# EAGLE design room_sensor_esp32_old (EAGLE 9.6.2)
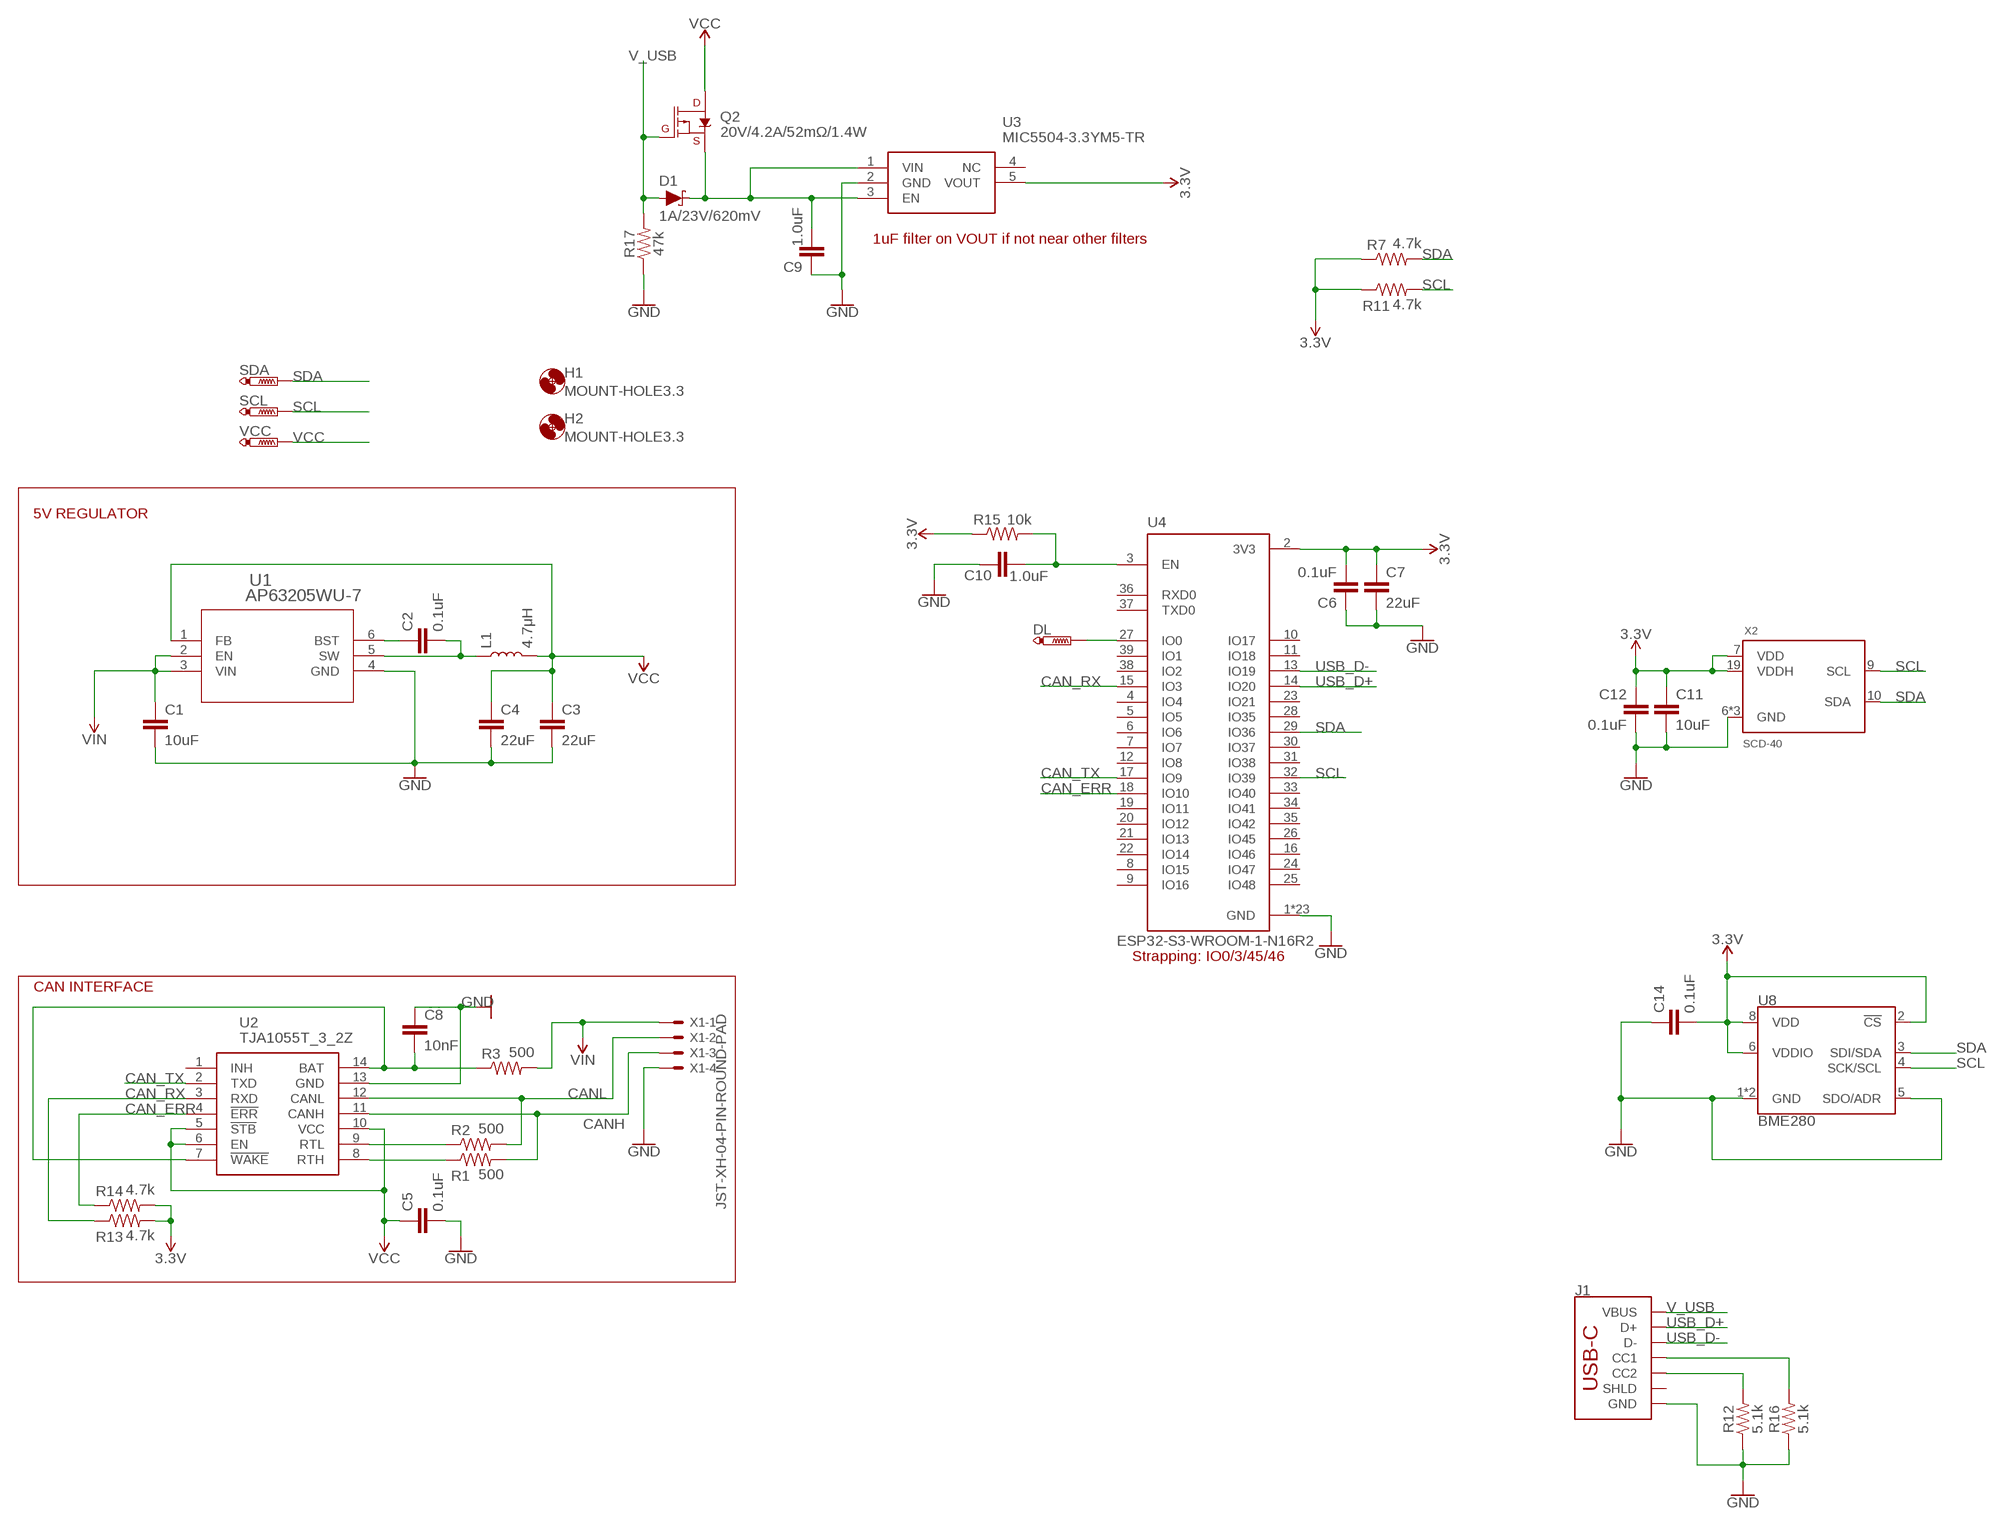
[diagram p0: schematic, sheet 1]

## Parts
C1  10uF  10UF-1210-50V-20%  [1210]
C2  0.1uF  0.1UF-0603-25V-5%  [0603]
C3  22uF  22UF-0805-6.3V-20%  [0805]
C4  22uF  22UF-0805-6.3V-20%  [0805]
C5  0.1uF  0.1UF-0603-25V-5%  [0603]
C6  0.1uF  0.1UF-0603-25V-5%  [0603]
C7  22uF  22UF-0805-6.3V-20%  [0805]
C8  10nF  10NF-0603-50V-10%  [0603]
C9  1.0uF  1.0UF-0603-16V-10%  [0603]
C10  1.0uF  1.0UF-0603-16V-10%  [0603]
C11  10uF  10UF-1210-50V-20%  [1210]
C12  0.1uF  0.1UF-0603-25V-5%  [0603]
C14  0.1uF  0.1UF-0603-25V-5%  [0603]
D1  1A/23V/620mV  DIODE-SCHOTTKY-BAT20J  [SOD-323]
DL  PTR1B1,27  [B1,27]
H1  MOUNT-HOLE3.3  [3,3]
H2  MOUNT-HOLE3.3  [3,3]
J1  USB_C_2-LAYER_PADS  [USB-C-16P-2LAYER-PADS]
L1  4.7μH  4.7μH_SHIELDED_INDUCTORNPIS_LS  [INDUCTOR_4X4MM]
Q2  20V/4.2A/52mΩ/1.4W  MOSFET_PCH-DMG2305UX-7  [SOT23-3]
R1  500  RESISTOR0603  [0603]
R2  500  RESISTOR0603  [0603]
R3  500  RESISTOR0603  [0603]
R7  4.7k  4.7KOHM-0603-1/10W-1%  [0603]
R11  4.7k  4.7KOHM-0603-1/10W-1%  [0603]
R12  5.1k  5.1KOHM5.1KOHM-0603-1/10W-1%  [0603]
R13  4.7k  4.7KOHM-0603-1/10W-1%  [0603]
R14  4.7k  4.7KOHM-0603-1/10W-1%  [0603]
R15  10k  10KOHM-0603-1/10W-1%  [0603]
R16  5.1k  5.1KOHM5.1KOHM-0603-1/10W-1%  [0603]
R17  47k  47KOHM-0603-1/10W-1%  [0603]
SCL  PTR1B1,27  [B1,27]
SDA  PTR1B1,27  [B1,27]
U1  AP63205WU-7  [SOIC_05WU-7_DIO]
U2  TJA1055T_3_2Z  [SOIC127P600X175-14N]
U3  MIC5504-3.3YM5-TR  [SOT95P280X145-5N]
U4  ESP32-S3-WROOM-1-N16R2  [XCVR_ESP32-S3-WROOM-1-N16R2]
U8  BME280  [LGA-8-2.5X2.5]
VCC  PTR1B1,27  [B1,27]
X1  JST-XH-04-PIN-ROUND-PAD  [JST-XH-04-PACKAGE-ROUND-PAD]
X2  SCD-40  [SCD40]

## Nets
3.3V: C6.2 C7.1 C11.1 C12.2 C14.2 R7.1 R11.1 R13.2 R14.2 R15.1 U3.5(VOUT) U4.2(3V3) U8.2(!CS) U8.6(VDDIO) U8.8(VDD) X2.7(VDD) X2.19(VDDH)
CAN_ERR: R14.1 U2.4(!ERR) U4.18(IO10)
CAN_RX: R13.1 U2.3(RXD) U4.15(IO3)
CAN_TX: U2.2(TXD) U4.17(IO9)
CANH: R1.2 U2.11(CANH) X1.3
CANL: R2.2 U2.12(CANL) X1.2
GND: C1.2 C3.2 C4.2 C5.2 C6.1 C7.2 C8.1 C9.1 C10.1 C11.2 C12.1 C14.1 J1.GND J1.GND2(GND) R12.1 R16.1 R17.1 U1.4(GND) U2.13(GND) U3.2(GND) U4.1(GND) U4.40(GND) U4.41_1(GND) U4.41_2(GND) U4.41_3(GND) U4.41_4(GND) U4.41_5(GND) U4.41_6(GND) U4.41_7(GND) U4.41_8(GND) U4.41_9(GND) U4.41_10(GND) U4.41_11(GND) U4.41_12(GND) U4.41_13(GND) U4.41_14(GND) U4.41_15(GND) U4.41_16(GND) U4.41_17(GND) U4.41_18(GND) U4.41_19(GND) U4.41_20(GND) U4.41_21(GND) U8.1(GND) U8.5(SDO/ADR) U8.7(GND) X1.4 X2.6(GND) X2.20(GND) X2.P$1(GND)
N$1: C2.2 L1.P$1 U1.5(SW)
N$2: C2.1 U1.6(BST)
N$3: DL.TP U4.27(IO0)
N$5: R2.1 U2.9(RTL)
N$6: R1.1 U2.8(RTH)
N$7: J1.A5(CC1) R16.2
N$8: C8.2 R3.1 U2.7(!WAKE) U2.14(BAT)
N$9: C10.2 R15.2 U4.3(EN)
N$14: J1.B5(CC2) R12.2
REG_IN: C9.2 D1.C Q2.2(S) U3.1(VIN) U3.3(EN)
SCL: R11.2 SCL.TP U4.32(IO39) U8.4(SCK/SCL) X2.9(SCL)
SDA: R7.2 SDA.TP U4.29(IO36) U8.3(SDI/SDA) X2.10(SDA)
USB_D+: J1.A6(D+) J1.B6(D+) U4.14(IO20)
USB_D-: J1.A7(D-) J1.B7(D-) U4.13(IO19)
V_USB: D1.A J1.VBUS1(VBUS) J1.VBUS2(VBUS) Q2.1(G) R17.2
VCC: C3.1 C4.1 C5.1 L1.P$2 Q2.3(D) U1.1(FB) U2.5(!STB) U2.6(EN) U2.10(VCC) VCC.TP
VIN: C1.1 R3.2 U1.2(EN) U1.3(VIN) X1.1
Unconnected: J1.SHLD1(SHLD) J1.SHLD2(SHLD) J1.SHLD3(SHLD) J1.SHLD4(SHLD) U2.1(INH) U3.4(NC) U4.4(IO4) U4.5(IO5) U4.6(IO6) U4.7(IO7) U4.8(IO15) U4.9(IO16) U4.10(IO17) U4.11(IO18) U4.12(IO8) U4.16(IO46) U4.19(IO11) U4.20(IO12) U4.21(IO13) U4.22(IO14) U4.23(IO21) U4.24(IO47) U4.25(IO48) U4.26(IO45) U4.28(IO35) U4.30(IO37) U4.31(IO38) U4.33(IO40) U4.34(IO41) U4.35(IO42) U4.36(RXD0) U4.37(TXD0) U4.38(IO2) U4.39(IO1)

## Notes on the sheet
- 1uF filter on VOUT if not near other filters
- 5V REGULATOR
- Strapping: IO0/3/45/46
- CAN INTERFACE

## Library data of the parts
C1 C11 = SparkFun-Capacitors:10UF: 10.0µF ceramic capacitors A capacitor is a passive two-terminal electrical component used to store electrical energy temporarily in an electric field.; PROD_ID: CAP-09824
C2 C5 C6 C12 C14 = SparkFun-Capacitors:0.1UF: 0.1µF ceramic capacitors A capacitor is a passive two-terminal electrical component used to store electrical energy temporarily in an electric field.; PROD_ID: CAP-08604
C3 C4 C7 = SparkFun-Capacitors:22UF: 22µF ceramic capacitors A capacitor is a passive two-terminal electrical component used to store electrical energy temporarily in an electric field.; PROD_ID: CAP-08402
C8 = SparkFun-Capacitors:10NF: 0.01uF/10nF/10,000pF ceramic capacitors A capacitor is a passive two-terminal electrical component used to store electrical energy temporarily in an electric field. CAP-09321; PROD_ID: CAP-00867
C9 C10 = SparkFun-Capacitors:1.0UF: 1µF ceramic capacitors A capacitor is a passive two-terminal electrical component used to store electrical energy temporarily in an electric field.; PROD_ID: CAP-00868
D1 = SparkFun-DiscreteSemi:DIODE-SCHOTTKY: Schottky diode A Schottky diode is a semiconductor diode which has a low forward voltage drop and a very fast switching action.; PROD_ID: DIO-11623
DL SCL SDA VCC = testpad:PTR1: TEST PIN
H1 H2 = holes:MOUNT-HOLE: MOUNTING HOLE with drill center marker
J1 = SparkFun-Connectors:USB_C: USB Type C 16Pin Connector Super Speed pins not available on the 16-pin purely SMD connector so this part is best for USB 2.0 implementations. D1 and D2 are tied together enabling D+/- no matter which way the cable is plugged into the connector. The two channel configuration pins (CC1/2) are exposed. These are normally connected to ground via 5.1k resistors but can be reconfigured for high current/high power applications. **4-LAYER BOARD WARNING!!** If designing 4-layer board, make sure to select the variant _4-LAYER-ISOLATED. The linked footprint (USB-C-16-4LAYER-ISOLATED) includes some very necessary cutout polygons in the inner layers (2 and 15). This prevents the PTH mounting shield legs on the USB connector from electrically connecting any other polygons on the inner layers (usually VCC and GND).; PROD_ID: CONN-14122
L1 = SparkFun-Coils:4.7μH_SHIELDED_INDUCTOR: 4.7uH Inductor 4.7uH 1.4A 50mOhm 1008(2520) Package Shielded; PROD_ID: NDUC-15245
Q2 = SparkFun-DiscreteSemi:MOSFET_PCH: P-channel MOSFETs Voltage controlled devices that allow control of high current outputs. SparkFun Products: SparkFun ESP32 Thing <https://www.sparkfun.com/products/13907> SparkFun ESP8266 Thing <https://www.sparkfun.com/products/13231> SparkFun Pi Servo HAT V2 <https://www.sparkfun.com/products/15316> DMG2305UX-7 (20V/4.2A/SOT23-3); PROD_ID: TRANS-14388
R1-R3 = SparkFun-Resistors:RESISTOR: Generic Resistor Package
R7 R11 R13 R14 = SparkFun-Resistors:4.7KOHM: 4.7kΩ resistor A resistor is a passive two-terminal electrical component that implements electrical resistance as a circuit element. Resistors act to reduce current flow, and, at the same time, act to lower voltage levels within circuits. - Wikipedia; PROD_ID: RES-07857
R12 R16 = SparkFun-Resistors:5.1KOHM; PROD_ID: RES-12083
R15 = SparkFun-Resistors:10KOHM: 10kΩ resistor A resistor is a passive two-terminal electrical component that implements electrical resistance as a circuit element. Resistors act to reduce current flow, and, at the same time, act to lower voltage levels within circuits. - Wikipedia; PROD_ID: RES-00824
R17 = SparkFun-Resistors:47KOHM: 47kΩ resistor A resistor is a passive two-terminal electrical component that implements electrical resistance as a circuit element. Resistors act to reduce current flow, and, at the same time, act to lower voltage levels within circuits. - Wikipedia; PROD_ID: RES-07871
U1 = Diodes buck converter:AP63205WU-7; COPYRIGHT: Copyright (C) 2023 Ultra Librarian. All rights reserved.; MANUFACTURER_PART_NUMBER: AP63205WU-7; MFR_NAME: Diodes Inc
U2 = TJA1055T_3_2Z:TJA1055T_3_2Z: CAN Interface IC Enhanced fault-tolerant CAN transceiver Source: Datasheet <http://www.nxp.com/docs/en/data-sheet/TJA1055.pdf>; DESCRIPTION: CAN Interface IC Enhanced fault-tolerant CAN transceiver; HEIGHT: 1.75mm; MANUFACTURER_NAME: NXP; MANUFACTURER_PART_NUMBER: TJA1055T/3/2Z; MOUSER_PART_NUMBER: 771-TJA1055T/3/2Z; MOUSER_PRICE-STOCK: https://www.mouser.co.uk/ProductDetail/NXP-Semiconductors/TJA1055T-3-2Z?qs=qSfuJ%252Bfl%2Fd73Y%2FIsMw3Ayg%3D%3D
U3 = MIC5504-3.3YM5-TR:MIC5504-3.3YM5-TR: MICROCHIP - MIC5504-3.3YM5-TR - LDO VOLT REG, 0.3A, 3.3V, SOT-23-5 Source: Datasheet <https://componentsearchengine.com/Datasheets/2/MIC5504-3.3YM5-TR.pdf>; DESCRIPTION: MICROCHIP - MIC5504-3.3YM5-TR - LDO VOLT REG, 0.3A, 3.3V, SOT-23-5; HEIGHT: 1.45mm; MANUFACTURER_NAME: Microchip; MANUFACTURER_PART_NUMBER: MIC5504-3.3YM5-TR; MOUSER_PART_NUMBER: 998-MIC5504-3.3YM5TR; MOUSER_PRICE-STOCK: https://www.mouser.co.uk/ProductDetail/Microchip-Technology/MIC5504-3.3YM5-TR?qs=U6T8BxXiZAUmVQ5Zs217qQ%3D%3D
U4 = ESP32-S3-WROOM-1-N16R2:ESP32-S3-WROOM-1-N16R2: Check availability <https://pricing.snapeda.com/parts/ESP32S3WROOM1N16R2/Espressif%20Systems/view-part?ref=eda>; AVAILABILITY: In Stock; CHECK_PRICES: https://www.snapeda.com/parts/ESP32S3WROOM1N16R2/Espressif+Systems/view-part/?ref=eda; DESCRIPTION: Bluetooth, WiFi 802.11b/g/n, Bluetooth v5.0 Transceiver Module 2.4GHz PCB Trace Surface Mount; MF: Espressif Systems; MP: ESP32S3WROOM1N16R2; PACKAGE: NON STANDARD Espressif Systems; PRICE: None; PURCHASE-URL: https://www.snapeda.com/api/url_track_click_mouser/?unipart_id=10874217&manufacturer=Espressif Systems&part_name=ESP32S3WROOM1N16R2&search_term=None; SNAPEDA_LINK: https://www.snapeda.com/parts/ESP32S3WROOM1N16R2/Espressif+Systems/view-part/?ref=snap
U8 = SparkFun-Sensors:BME280: Bosch BME280 – Combined Humidity and Pressure Sensor The BME280 is as combined digital humidity, pressure and temperature sensor based on proven sensing principles. The sensor module is housed in an extremely compact metal-lid LGA package with a footprint of only 2.5×2.5mm² with a height of 0.93mm. Its small dimensions and its low power consumption allow the implementation in battery driven devices such as handsets, GPS modules or watches. Datasheet <https://cdn.sparkfun.com/assets/learn_tutorials/4/1/9/BST-BME280_DS001-10.pdf> SparkFun Products SparkFun Atmospheric Sensor Breakout - BME280 <https://www.sparkfun.com/products/13676> (SEN-13676); PROD_ID: IC-13090
X1 = Rembrandt Electronics - JST XH Connectors v1-0:JST-XH-04-PIN: JST XH Connector 2 Pin Wire to board connector. Pitch: 2,54 mm, (0.100") Number of pins: 4 Created by Rembrandt Electronics www.rembrandtelectronics.com
X2 = Adafruit SCD-41:SCD-40

## Board
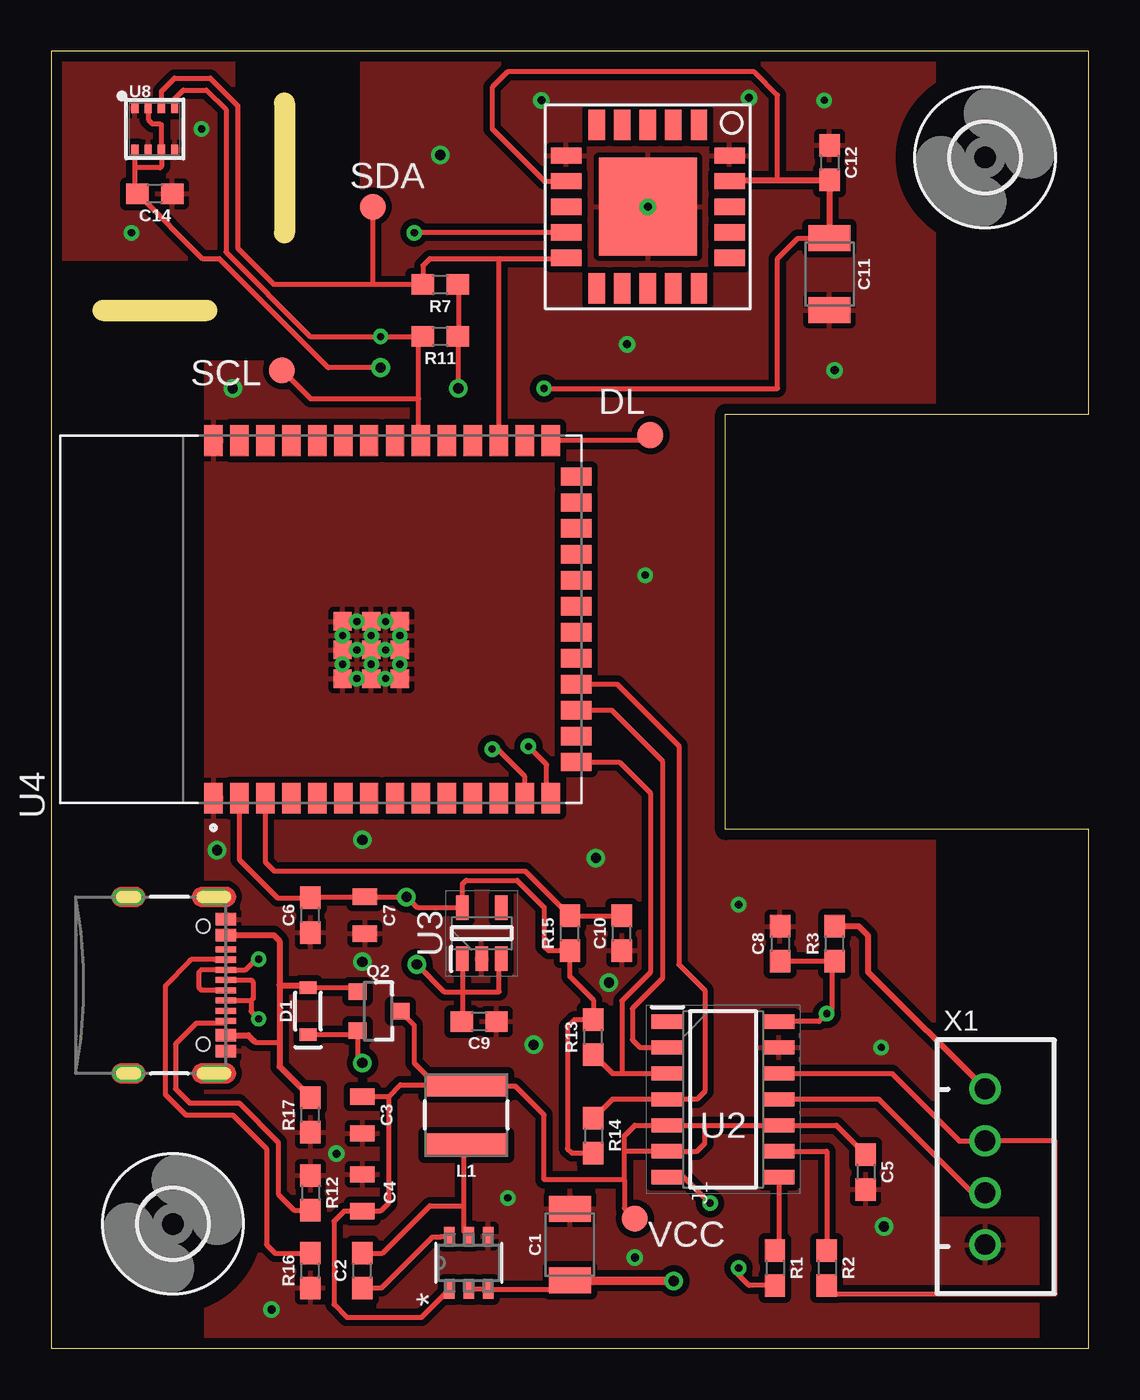
[diagram p1: board, top side]
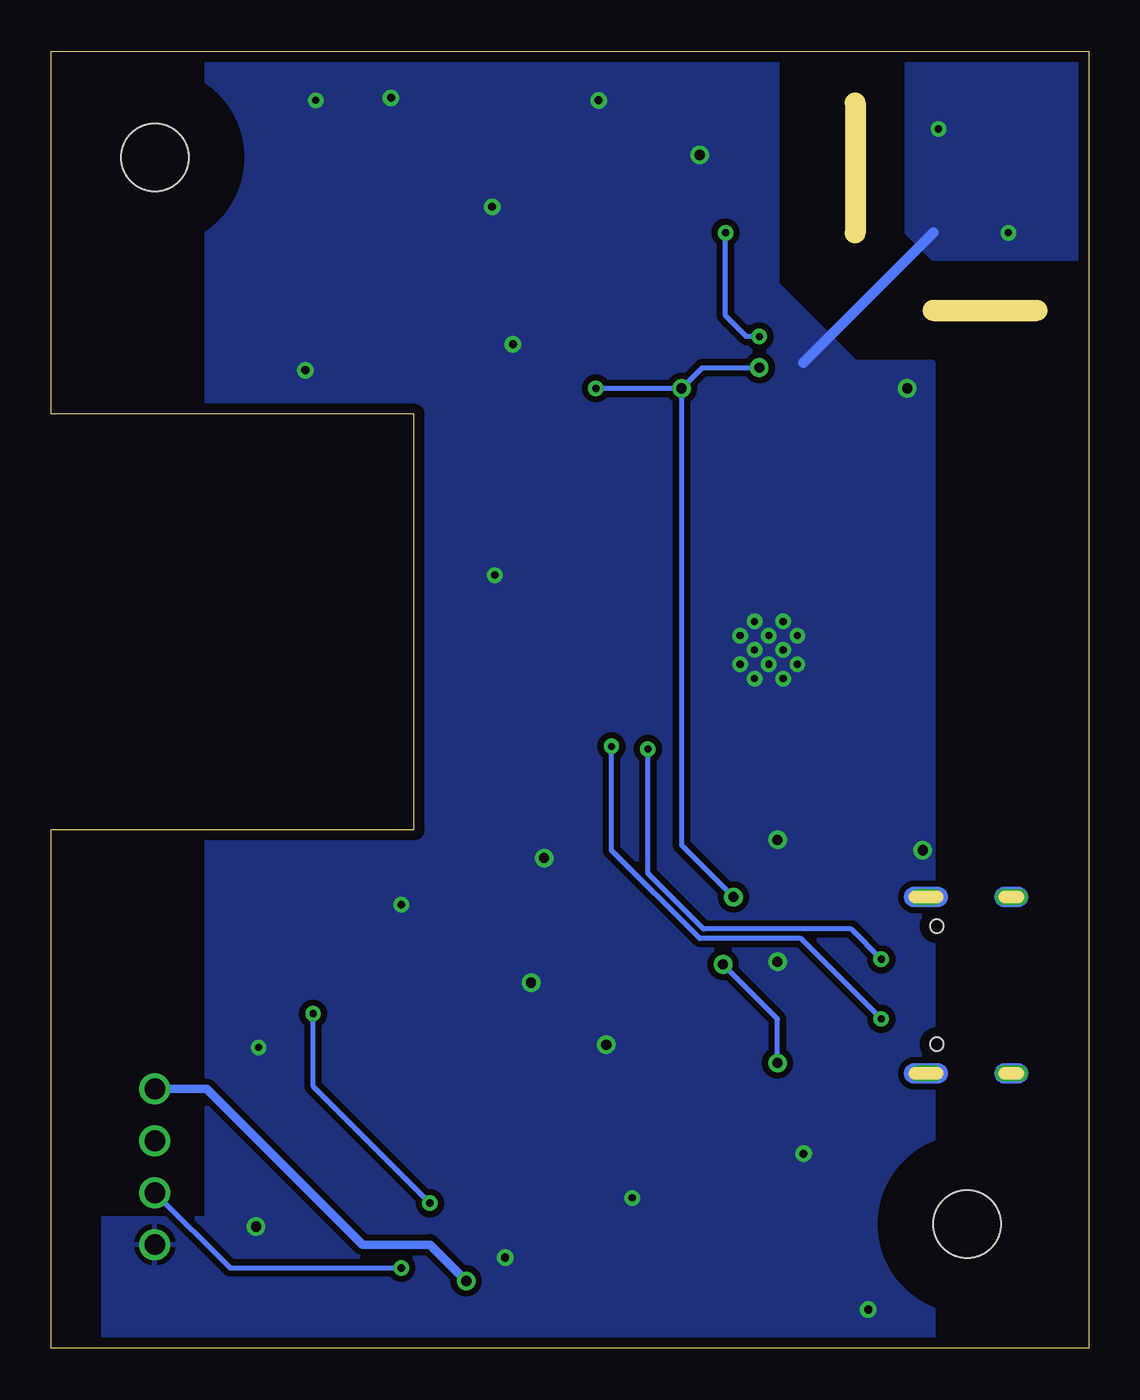
[diagram p2: board, bottom side, seen from below]

Size 50.8 x 63.5 mm. Coordinates in mm from the lower left corner, seen from the top.
Outline: 2.54,50.8 7.62,50.8
Outline: 11.43,60.96 11.43,54.61
Outline: 0,0 50.8,0 50.8,25.4 33.02,25.4 33.02,45.72 50.8,45.72 50.8,63.5 0,63.5 0,0
Copper layers (1*16): Top 0.035mm / dielectric 1.6mm / Bottom 0.035mm
Design rules "Elecrow_2-layer_PCB_eagle_rule_conservative": minimum track width 8mil, minimum drill 12mil, track to track 8mil, track to pad 6mil, pad to pad 6mil, via to via 8mil, smd to smd 0mil, copper to edge 20mil, drill to drill 10mil, minimum pad ring 8mil, minimum via ring 8mil, stop-mask expansion 0mil, vias tented up to drill 100mil, thermal gap 10mil
Milling: 2 lines

### Footprints (pad centres in the part's own frame; a part is rotated, then mirrored left to right if it is on the bottom)
1210 = smd 1.27 x 2.06: 1 -1.755,0; 2 1.755,0
0603 = smd 1.1 x 1: 1 -0.85,0; 2 0.85,0
0805 = smd 0.8 x 1.2: 1 -0.9,0; 2 0.9,0
SOD-323 = smd 0.63 x 0.83: A 1.15,0; C -1.15,0
B1,27 = smd 1.27 x 1.27: TP 0,0
3,3 = hole 3.3: 0,0
USB-C-16P-2LAYER-PADS = smd 0.3 x 1: A5 -1.25,-0.34; A6 -0.25,-0.34; A7 0.25,-0.34; A8 1.25,-0.34; B5 1.75,-0.34; B6 0.75,-0.34; B7 -0.75,-0.34; B8 -1.75,-0.34 | smd 0.6 x 1: GND -3.225,-0.34; GND2 3.225,-0.34; VBUS1 -2.45,-0.34; VBUS2 2.45,-0.34 | drill 0.4 pad 0.6 long: SHLD1 -4.318,-0.915; SHLD2 4.318,-0.915; SHLD3 -4.318,-5.095; SHLD4 4.318,-5.095 | hole 0.65: -2.89,-1.445; 2.89,-1.445
INDUCTOR_4X4MM = smd 4.089 x 1.143: P$1 0,1.473; P$2 0,-1.473
SOT23-3 = smd 0.8 x 0.9: 1 -0.95,-1; 2 0.95,-1; 3 0,1.1
SOIC_05WU-7_DIO = smd 0.902 x 0.508: 1 -1.302,0.95; 2 -1.302,0; 3 -1.302,-0.95; 4 1.302,-0.95; 5 1.302,0; 6 1.302,0.95
SOIC127P600X175-14N = smd 1.55 x 0.7: 1 -2.725,3.81; 2 -2.725,2.54; 3 -2.725,1.27; 4 -2.725,0; 5 -2.725,-1.27; 6 -2.725,-2.54; 7 -2.725,-3.81; 8 2.725,-3.81; 9 2.725,-2.54; 10 2.725,-1.27; 11 2.725,0; 12 2.725,1.27; 13 2.725,2.54; 14 2.725,3.81
SOT95P280X145-5N = smd 1.2 x 0.6: 1 -1.25,0.95; 2 -1.25,0; 3 -1.25,-0.95; 4 1.25,-0.95; 5 1.25,0.95
XCVR_ESP32-S3-WROOM-1-N16R2 = smd 1.5 x 0.9: 1 -8.75,5.26; 2 -8.75,3.99; 3 -8.75,2.72; 4 -8.75,1.45; 5 -8.75,0.18; 6 -8.75,-1.09; 7 -8.75,-2.36; 8 -8.75,-3.63; 9 -8.75,-4.9; 10 -8.75,-6.17; 11 -8.75,-7.44; 12 -8.75,-8.71; 13 -8.75,-9.98; 14 -8.75,-11.25; 27 8.75,-11.25; 28 8.75,-9.98; 29 8.75,-8.71; 30 8.75,-7.44; 31 8.75,-6.17; 32 8.75,-4.9; 33 8.75,-3.63; 34 8.75,-2.36; 35 8.75,-1.09; 36 8.75,0.18; 37 8.75,1.45; 38 8.75,2.72; 39 8.75,3.99; 40 8.75,5.26 | smd 0.9 x 1.5: 15 -6.985,-12.5; 16 -5.715,-12.5; 17 -4.445,-12.5; 18 -3.175,-12.5; 19 -1.905,-12.5; 20 -0.635,-12.5; 21 0.635,-12.5; 22 1.905,-12.5; 23 3.175,-12.5; 24 4.445,-12.5; 25 5.715,-12.5; 26 6.985,-12.5 | smd 0.9 x 0.9: 41_1 -1.5,-2.46; 41_2 -2.9,-2.46; 41_3 -0.1,-2.46; 41_4 -2.9,-3.86; 41_5 -1.5,-3.86; 41_6 -0.1,-3.86; 41_7 -2.9,-1.06; 41_8 -1.5,-1.06; 41_9 -0.1,-1.06 | drill 0.35 pad 0.61: 41_10 -1.5,-1.76; 41_11 -2.9,-1.76; 41_12 -0.1,-1.76; 41_13 -2.9,-3.16; 41_14 -1.5,-3.16; 41_15 -0.1,-3.16; 41_16 -2.2,-1.06; 41_17 -0.8,-1.06; 41_18 -2.2,-2.46; 41_19 -0.8,-2.46; 41_20 -2.2,-3.86; 41_21 -0.8,-3.86
LGA-8-2.5X2.5 = smd 0.35 x 0.5: 1 -0.975,1.025; 2 -0.325,1.025; 3 0.325,1.025; 4 0.975,1.025; 5 0.975,-1.025; 6 0.325,-1.025; 7 -0.325,-1.025; 8 -0.975,-1.025
JST-XH-04-PACKAGE-ROUND-PAD = drill 1.016: 1 -3.81,0; 2 -1.27,0; 3 1.27,0; 4 3.81,0
SCD40 = smd 1.5 x 0.8: 1 -4,2.5; 2 -4,1.25; 3 -4,0; 4 -4,-1.25; 5 -4,-2.5; 11 4,-2.5; 12 4,-1.25; 13 4,0; 14 4,1.25; 15 4,2.5 | smd 0.8 x 1.5: 6 -2.5,-4; 7 -1.25,-4; 8 0,-4; 9 1.25,-4; 10 2.5,-4; 16 2.5,4; 17 1.25,4; 18 0,4; 19 -1.25,4; 20 -2.5,4 | smd 4.8 x 4.8: P$1 0,0

### Placement (x,y rotation side)
C1  25.4,5.08 90 top
C2  15.24,3.81 90 top
C3  15.24,11.43 270 top
C4  15.24,7.62 90 top
C5  39.88,8.64 270 top
C6  12.7,21.21 90 top
C7  15.37,21.21 270 top
C8  35.69,19.81 270 top
C9  20.95,16 180 top
C10  27.94,20.32 90 top
C11  38.1,52.58 270 top
C12  38.1,58.04 270 top
C14  5.08,56.52 180 top
D1  12.57,16.51 90 top
DL  29.34,44.7 0 top
H1  5.97,6.1 0 top
H2  45.72,58.29 0 top
J1  8.89,17.78 270 top
L1  20.32,11.43 180 top
Q2  16,16.51 270 top
R1  35.43,3.94 270 top
R2  37.97,3.94 270 top
R3  38.35,19.81 90 top
R7  19.05,52.07 180 top
R11  19.05,49.53 180 top
R12  12.7,7.62 270 top
R13  26.54,15.24 90 top
R14  26.54,10.41 270 top
R15  25.4,20.32 90 top
R16  12.7,3.81 90 top
R17  12.7,11.43 90 top
SCL  11.3,47.88 0 top
SDA  15.75,55.88 0 top
U1  20.45,4.19 90 top
U2  32.89,12.19 0 top
U3  21.08,20.32 90 top
U4  13.21,35.69 90 top
U8  5.08,59.69 0 top
VCC  28.57,6.35 0 top
X1  45.72,8.89 270 top
X2  29.21,55.88 270 top

### Tracks (layer width: path | path; a pad name or v marks a point on that pad's centre or on a via)
3.3V  (via drill 0.35, 0.5)
  Top 0.254: U8.8 4.11,57.78 | 4.11,57.78 4.11,56.64 C14.2 7.41,53.34 8.23,53.34 13.57,48.01 v16.13,48.01 | 4.11,57.78 5.33,57.78 5.41,57.86 U8.6 5.41,59.87 5.33,59.94 4.95,59.94 4.75,60.14 U8.2 | R14.2 25.49,9.56 25.27,9.78 25.27,15.75 25.61,16.09 R13.2 26.54,17.06 25.4,18.2 R15.1 24.34,19.47 24.13,19.68 24.13,21.59 22.81,22.91 20.32,22.91 20.13,22.72 20.13,21.59 | U4.2 9.22,23.93 11.09,22.06 C6.2 12.75,22.11 C7.1 17.39,22.11 v17.4,22.1 17.91,21.59 20.13,21.59 | U3.5 20.13,21.59 | v19.94,46.99 19.94,49.49 | 19.94,49.49 R11.1 | R7.1 19.94,52.03 19.94,49.49 | 35.56,57.19 35.56,61.34 34.42,62.48 22.35,62.48 21.59,61.72 21.59,59.69 24.15,57.13 X2.7 | v24.13,46.99 35.56,46.99 35.56,53.34 36.55,54.33 C11.1
  Top 0.305: X2.19 33.27,57.19 35.56,57.19 C12.2 C11.1
  Bottom 0.254: v16.13,48.01 18.92,48.01 v19.94,46.99 | v19.94,46.99 19.94,24.64 v17.4,22.1 | v19.94,46.99 v24.13,46.99
CAN_ERR
  Top 0.254: R14.1 27.47,12.19 U2.4 31.62,12.19 32,12.57 32,17.53 30.73,18.8 30.73,29.49 27.71,32.51 U4.18
CAN_RX
  Top 0.254: 27.94,13.46 27.47,13.46 R13.1 | 27.94,13.46 U2.3 | U4.15 27.81,28.7 29.34,27.18 29.34,18.41 27.94,17.02 27.94,13.46
CAN_TX
  Top 0.254: U4.17 27.44,31.24 29.92,28.76 29.92,18.11 28.45,16.64 28.45,15.11 28.83,14.73 U2.2
CANH  (via drill 0.35)
  Top 0.254: X1.3 45.09,7.62 40.51,12.19 U2.11 | R1.2 34.16,3.09 33.66,3.6 v33.66,3.94
  Bottom 0.254: v33.66,3.94 42.04,3.94 X1.3
CANL
  Top 0.254: U2.12 41.15,13.46 44.45,10.16 X1.2 49.15,10.16 49.15,2.67 38.39,2.67 R2.2
GND  (via drill 0.35, 0.4, 0.5)
  Bottom 0.508: 7.62,54.61 13.97,48.26
  other vias: 3.94,54.61 7.37,59.69 28.57,4.45 28.19,49.15 29.08,37.85 37.85,61.09 33.66,21.72 40.64,14.73 22.35,7.37 10.79,1.91 13.97,9.53 26.67,24 15.24,18.92 8.13,24.38 23.62,14.86 40.77,5.97 15.24,24.89 27.3,17.91 19.05,58.42 8.89,46.99 34.16,61.21 24,61.09 38.35,47.88 29.21,55.88
  pour Top (isolate 0.305): 0,63.5 8.89,63.5 8.89,54.48 7.75,53.34 0,53.34
  pour Bottom (isolate 0.305): 0,63.5 0,53.34 7.62,53.34 8.89,54.61 8.89,63.5
  pour Bottom (isolate 0.305): 7.62,48.26 11.43,48.26 15.24,52.07 15.24,63.5 43.18,63.5 43.18,6.35 48.26,6.35 48.26,0 7.62,0
  pour Top (isolate 0.305): 7.62,48.26 11.43,48.26 15.24,52.07 15.24,63.5 43.18,63.5 43.18,6.35 48.26,6.35 48.26,0 7.62,0
  pour Bottom (no thermals): 12.7,36.83 19.05,36.83 19.05,30.48 12.7,30.48
N$1
  Top 0.254: U1.5 20.19,5.75 20.19,6.99 | L1.P$1 20.19,9.83 20.19,6.99 | C2.2 16.22,4.66 18.54,6.99 20.19,6.99
N$2
  Top 0.254: U1.6 19.46,5.46 19.05,5.46 18.67,5.46 16.17,2.96 C2.1
N$3
  Top 0.254: DL.TP 29.07,44.44 U4.27
N$5
  Top 0.254: U2.9 37.97,9.65 R2.1
N$6
  Top 0.254: R1.1 35.62,4.75 U2.8
N$7
  Top 0.254: R16.2 10.96,4.66 10.54,5.08 10.54,9.78 8.89,11.43 6.59,11.43 5.59,12.43 5.59,17.76 6.74,18.91 6.86,19.03 8.01,19.03 J1.A5
N$8  (via drill 0.35)
  Top 0.254: U2.14 37.59,16 v37.97,16.38 38.23,16.64 38.23,18.84 R3.1 C8.2 | v32.26,7.11 30.99,8.38 U2.7
  Bottom 0.254: v32.26,7.11 37.97,12.83 v37.97,16.38
N$9
  Top 0.254: U4.3 10.49,23.8 10.92,23.37 23.2,23.37 R15.2 C10.2
N$14
  Top 0.254: J1.B5 8.43,15.91 7.11,15.91 6.1,14.9 6.1,12.7 6.78,12.01 9.21,12.01 11.12,10.1 11.12,7.54 11.9,6.77 R12.2
REG_IN  (via drill 0.5)
  Top 0.254: D1.C 14.8,15.36 Q2.2 15,14.21 v15.24,13.97 | U3.3 21.93,18.97 21.93,17.46 20.13,17.46 | U3.1 20.13,17.46 | 20.13,17.46 20.13,16.03 C9.2 | v17.91,18.8 19.24,17.46 20.13,17.46
  Bottom 0.254: v15.24,13.97 15.24,16.13 v17.91,18.8
SCL  (via drill 0.35)
  Top 0.254: U8.4 6.05,61.17 6.48,61.59 7.61,61.59 8.56,60.64 8.56,53.66 12.69,49.53 v16.13,49.53 R11.2 17.99,49.32 17.99,46.48 | U4.32 17.99,44.55 17.99,46.48 | SCL.TP 12.7,46.48 17.99,46.48 | v17.78,54.61 17.8,54.63 X2.9
  Bottom 0.254: v16.13,49.53 16.76,49.53 17.78,50.55 v17.78,54.61
SDA
  Top 0.254: U4.29 21.92,52.07 21.92,52.63 21.92,53.29 21.97,53.34 | SDA.TP 15.75,52.07 | 15.75,52.07 R7.2 18.2,53 18.54,53.34 21.97,53.34 | 15.75,52.07 10.92,52.07 9.14,53.85 9.14,60.83 7.8,62.18 6.04,62.18 5.41,61.54 U8.3 | X2.10 25.17,53.34 21.97,53.34
USB_D+  (via drill 0.35)
  Top 0.254: J1.A6 9.78,18.03 9.91,17.91 9.91,17.14 9.79,17.03 | 9.79,17.03 9.79,16.5 v10.16,16.13 | U4.14 24.26,27.14 24.26,28.57 v23.37,29.46 | J1.B6 9.79,17.03
  Bottom 0.254: v10.16,16.13 14.1,20.07 19.05,20.07 23.37,24.38 v23.37,29.46
USB_D-  (via drill 0.35)
  Top 0.254: J1.A7 7.36,17.53 7.24,17.65 7.24,18.41 7.35,18.53 J1.B7 9.51,18.53 10.03,19.05 v10.16,19.05 | v21.59,29.34 21.84,29.34 23.19,27.99 U4.13
  Bottom 0.254: v10.16,19.05 11.63,20.52 18.86,20.52 21.59,23.25 v21.59,29.34
V_USB
  Top 0.254: D1.A 14.8,17.66 Q2.1 | 9.95,15.03 9.99,14.99 11.18,14.99
  Top 0.305: J1.VBUS2 9.65,15.33 9.95,15.03 | R17.2 11.18,13.8 11.18,14.99 11.18,17.78 | 11.18,17.78 12.45,17.78 D1.A | J1.VBUS1 10.88,20.23 11.18,19.94 11.18,17.78
VCC
  Top 0.254: C5.1 38.44,10.92 U2.10 32,10.92 | 32,10.92 U2.5 28.57,10.92 28.07,10.41 28.07,9.65 | 28.07,8.26 24.13,8.26 24.13,11.43 22.86,12.7 22.76,12.8 22.73,12.83 20.4,12.83 L1.P$2 | 28.07,8.26 28.07,9.65 | 28.07,9.65 U2.6 31.62,9.65 32,10.03 32,10.92 | U1.1 18.13,1.52 14.48,1.52 13.84,2.16 13.84,6.22 14.34,6.72 C4.1 16.12,6.72 16.51,7.11 16.51,12.32 | 16.51,12.32 17.09,12.9 L1.P$2 | C3.1 16.5,12.33 16.51,12.32 | 28.07,8.26 28.07,6.86 VCC.TP | Q2.3 17.78,15.83 17.78,13.97 18.85,12.9 L1.P$2
VIN  (via drill 0.5)
  Top 0.254: U1.2 U1.3 25.01,2.89 25.42,3.3
  Top 0.305: X1.1 40.01,18.41 40.01,20.19 39.54,20.66 R3.2
  Top 0.406: v30.48,3.3 25.42,3.3 C1.1
  Bottom 0.406: X1.1 43.18,12.7 35.56,5.08 32.26,5.08 v30.48,3.3